# Altium schematic sheet LED Matrix.SchDoc: LED Matrix Page 1
size B; CheckedBy: Lance Bantoto; Engineer: Emily Adam*; Revision: 1; SheetNumber: 1; SheetTotal: 2
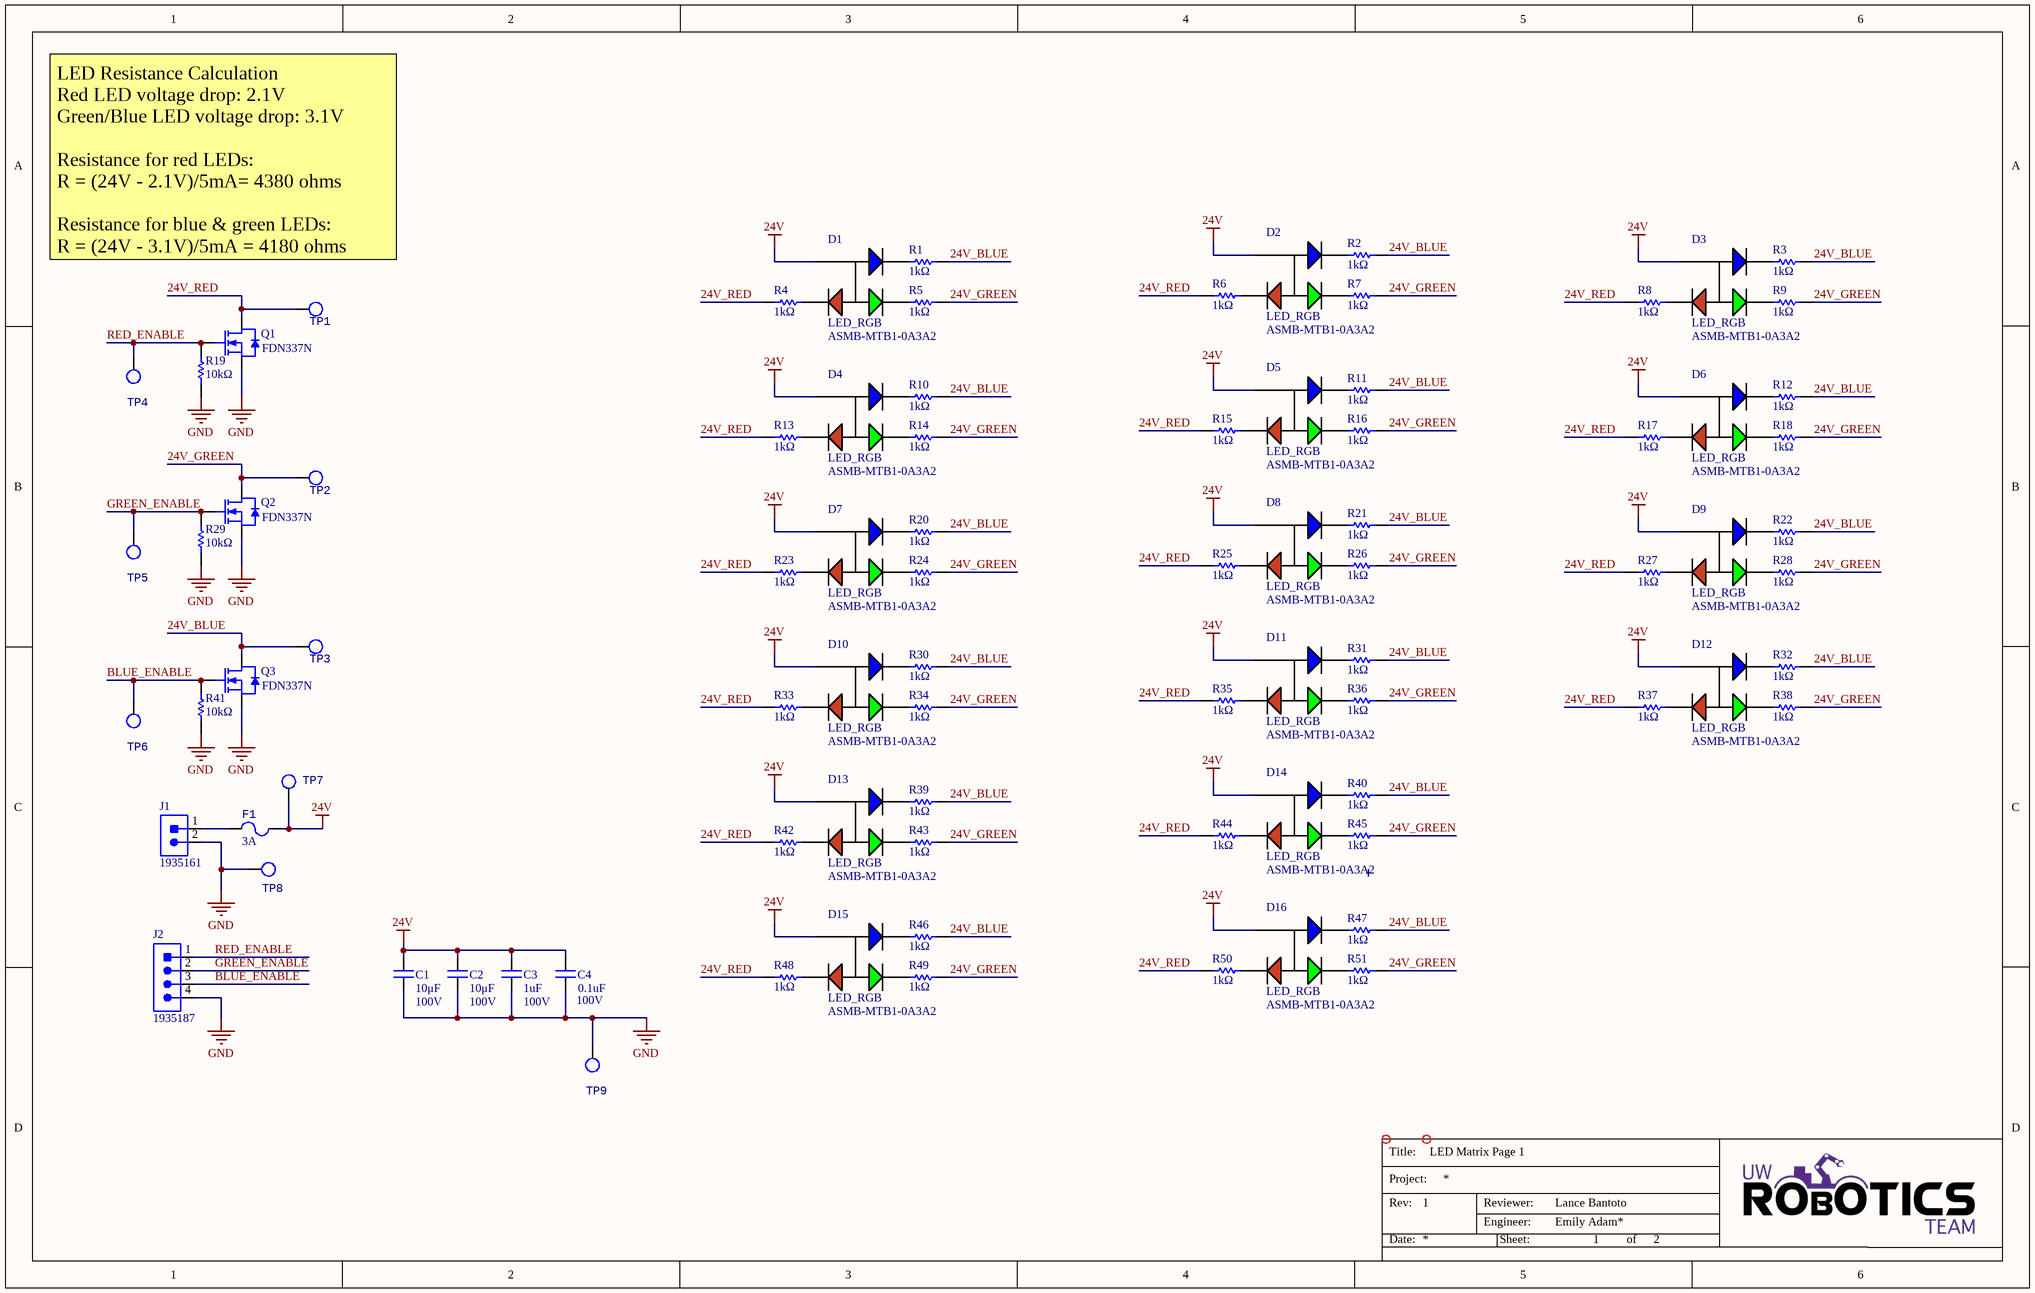
[diagram p0: LED Matrix.SchDoc]

## Parts
C1  value 10μF  Voltage Rating: 100V  [CAP1210]  (hidden comment: CAP_10uF_100V_1210)
C2  value 10μF  Voltage Rating: 100V  [CAP1210]  (hidden comment: CAP_10uF_100V_1210)
C3  Capacitance: 1uF  Voltage Rating: 100V  [CAPC3216X190X50NL20T25]  (hidden comment: CAP_1uF_100V_1206)
C4  Voltage Rating (DC): 100V  Capacitance: 0.1uF  [CAPC3216X180N]  (hidden comment: CAP_0.1uF_100V_1206)
D1  LED_RGB  Manufacturer Part Number 1: ASMB-MTB1-0A3A2  [LED_RGB]
D2  LED_RGB  Manufacturer Part Number 1: ASMB-MTB1-0A3A2  [LED_RGB]
D3  LED_RGB  Manufacturer Part Number 1: ASMB-MTB1-0A3A2  [LED_RGB]
D4  LED_RGB  Manufacturer Part Number 1: ASMB-MTB1-0A3A2  [LED_RGB]
D5  LED_RGB  Manufacturer Part Number 1: ASMB-MTB1-0A3A2  [LED_RGB]
D6  LED_RGB  Manufacturer Part Number 1: ASMB-MTB1-0A3A2  [LED_RGB]
D7  LED_RGB  Manufacturer Part Number 1: ASMB-MTB1-0A3A2  [LED_RGB]
D8  LED_RGB  Manufacturer Part Number 1: ASMB-MTB1-0A3A2  [LED_RGB]
D9  LED_RGB  Manufacturer Part Number 1: ASMB-MTB1-0A3A2  [LED_RGB]
D10  LED_RGB  Manufacturer Part Number 1: ASMB-MTB1-0A3A2  [LED_RGB]
D11  LED_RGB  Manufacturer Part Number 1: ASMB-MTB1-0A3A2  [LED_RGB]
D12  LED_RGB  Manufacturer Part Number 1: ASMB-MTB1-0A3A2  [LED_RGB]
D13  LED_RGB  Manufacturer Part Number 1: ASMB-MTB1-0A3A2  [LED_RGB]
D14  LED_RGB  Manufacturer Part Number 1: ASMB-MTB1-0A3A2  [LED_RGB]
D15  LED_RGB  Manufacturer Part Number 1: ASMB-MTB1-0A3A2  [LED_RGB]
D16  LED_RGB  Manufacturer Part Number 1: ASMB-MTB1-0A3A2  [LED_RGB]
F1  Current Rating: 3A  [FUSE_1206]  (hidden comment: FUSE_3A_1206)
J1  CON_2M_TERM  [1935161]  (value not drawn)
J2  CON_4M_TERM  [1935187]  (value not drawn)
MH1  MOUNTING_HOLES  [MOUNTING_HOLE]  (value not drawn)
MH2  MOUNTING_HOLES  [MOUNTING_HOLE]  (value not drawn)
Q1  Manufacturer Part Number 1: FDN337N  [NMOS_SSOT-3]  (hidden comment: NMOS_30V_2.2A)
Q2  Manufacturer Part Number 1: FDN337N  [NMOS_SSOT-3]  (hidden comment: NMOS_30V_2.2A)
Q3  Manufacturer Part Number 1: FDN337N  [NMOS_SSOT-3]  (hidden comment: NMOS_30V_2.2A)
R1  1kΩ  [RESC2012X60N]
R2  1kΩ  [RESC2012X60N]
R3  1kΩ  [RESC2012X60N]
R4  1kΩ  [RESC2012X60N]
R5  1kΩ  [RESC2012X60N]
R6  1kΩ  [RESC2012X60N]
R7  1kΩ  [RESC2012X60N]
R8  1kΩ  [RESC2012X60N]
R9  1kΩ  [RESC2012X60N]
R10  1kΩ  [RESC2012X60N]
R11  1kΩ  [RESC2012X60N]
R12  1kΩ  [RESC2012X60N]
R13  1kΩ  [RESC2012X60N]
R14  1kΩ  [RESC2012X60N]
R15  1kΩ  [RESC2012X60N]
R16  1kΩ  [RESC2012X60N]
R17  1kΩ  [RESC2012X60N]
R18  1kΩ  [RESC2012X60N]
R19  value 10kΩ  [RESC2012X60N]  (hidden comment: RES_10kΩ_0805)
R20  1kΩ  [RESC2012X60N]
R21  1kΩ  [RESC2012X60N]
R22  1kΩ  [RESC2012X60N]
R23  1kΩ  [RESC2012X60N]
R24  1kΩ  [RESC2012X60N]
R25  1kΩ  [RESC2012X60N]
R26  1kΩ  [RESC2012X60N]
R27  1kΩ  [RESC2012X60N]
R28  1kΩ  [RESC2012X60N]
R29  value 10kΩ  [RESC2012X60N]  (hidden comment: RES_10kΩ_0805)
R30  1kΩ  [RESC2012X60N]
R31  1kΩ  [RESC2012X60N]
R32  1kΩ  [RESC2012X60N]
R33  1kΩ  [RESC2012X60N]
R34  1kΩ  [RESC2012X60N]
R35  1kΩ  [RESC2012X60N]
R36  1kΩ  [RESC2012X60N]
R37  1kΩ  [RESC2012X60N]
R38  1kΩ  [RESC2012X60N]
R39  1kΩ  [RESC2012X60N]
R40  1kΩ  [RESC2012X60N]
R41  value 10kΩ  [RESC2012X60N]  (hidden comment: RES_10kΩ_0805)
R42  1kΩ  [RESC2012X60N]
R43  1kΩ  [RESC2012X60N]
R44  1kΩ  [RESC2012X60N]
R45  1kΩ  [RESC2012X60N]
R46  1kΩ  [RESC2012X60N]
R47  1kΩ  [RESC2012X60N]
R48  1kΩ  [RESC2012X60N]
R49  1kΩ  [RESC2012X60N]
R50  1kΩ  [RESC2012X60N]
R51  1kΩ  [RESC2012X60N]
TP1  TESTPOINT_LOOP  [TESTPOINT_LOOP]  (value not drawn)
TP2  TESTPOINT_LOOP  [TESTPOINT_LOOP]  (value not drawn)
TP3  TESTPOINT_LOOP  [TESTPOINT_LOOP]  (value not drawn)
TP4  TESTPOINT_LOOP  [TESTPOINT_LOOP]  (value not drawn)
TP5  TESTPOINT_LOOP  [TESTPOINT_LOOP]  (value not drawn)
TP6  TESTPOINT_LOOP  [TESTPOINT_LOOP]  (value not drawn)
TP7  TESTPOINT_LOOP  [TESTPOINT_LOOP]  (value not drawn)
TP8  TESTPOINT_LOOP  [TESTPOINT_LOOP]  (value not drawn)
TP9  TESTPOINT_LOOP  [TESTPOINT_LOOP]  (value not drawn)

## Nets
24V: C1.2 C2.2 C3.1 C4.2 D1.4(COMMON_ANODE) D2.4(COMMON_ANODE) D3.4(COMMON_ANODE) D4.4(COMMON_ANODE) D5.4(COMMON_ANODE) D6.4(COMMON_ANODE) D7.4(COMMON_ANODE) D8.4(COMMON_ANODE) D9.4(COMMON_ANODE) D10.4(COMMON_ANODE) D11.4(COMMON_ANODE) D12.4(COMMON_ANODE) D13.4(COMMON_ANODE) D14.4(COMMON_ANODE) D15.4(COMMON_ANODE) D16.4(COMMON_ANODE) F1.1 TP7.1
GND: C1.1 C2.1 C3.2 C4.1 J1.2 J2.4 Q1.2(SOURCE) Q2.2(SOURCE) Q3.2(SOURCE) R19.1 R29.1 R41.1 TP8.1 TP9.1
24V_BLUE: Q3.3(DRAIN) R1.2 R2.2 R3.2 R10.2 R11.2 R12.2 R20.1 R21.1 R22.1 R30.2 R31.2 R32.2 R39.1 R40.2 R46.2 R47.2 TP3.1
24V_GREEN: Q2.3(DRAIN) R5.2 R7.2 R9.2 R14.2 R16.2 R18.2 R24.2 R26.2 R28.2 R34.2 R36.2 R38.2 R43.2 R45.2 R49.2 R51.2 TP2.1
24V_RED: Q1.3(DRAIN) R4.1 R6.1 R8.1 R13.1 R15.1 R17.1 R23.2 R25.1 R27.1 R33.1 R35.1 R37.1 R42.1 R44.1 R48.1 R50.1 TP1.1
BLUE_ENABLE: J2.3 Q3.1(GATE) R41.2 TP6.1
GREEN_ENABLE: J2.2 Q2.1(GATE) R29.2 TP5.1
RED_ENABLE: J2.1 Q1.1(GATE) R19.2 TP4.1
NetD1_1: D1.1(CATHODE_(RED)) R4.2
NetD1_2: D1.2(CATHODE_(GREEN)) R5.1
NetD1_3: D1.3(CATHODE_(BLUE)) R1.1
NetD2_1: D2.1(CATHODE_(RED)) R6.2
NetD2_2: D2.2(CATHODE_(GREEN)) R7.1
NetD2_3: D2.3(CATHODE_(BLUE)) R2.1
NetD3_1: D3.1(CATHODE_(RED)) R8.2
NetD3_2: D3.2(CATHODE_(GREEN)) R9.1
NetD3_3: D3.3(CATHODE_(BLUE)) R3.1
NetD4_1: D4.1(CATHODE_(RED)) R13.2
NetD4_2: D4.2(CATHODE_(GREEN)) R14.1
NetD4_3: D4.3(CATHODE_(BLUE)) R10.1
NetD5_1: D5.1(CATHODE_(RED)) R15.2
NetD5_2: D5.2(CATHODE_(GREEN)) R16.1
NetD5_3: D5.3(CATHODE_(BLUE)) R11.1
NetD6_1: D6.1(CATHODE_(RED)) R17.2
NetD6_2: D6.2(CATHODE_(GREEN)) R18.1
NetD6_3: D6.3(CATHODE_(BLUE)) R12.1
NetD7_1: D7.1(CATHODE_(RED)) R23.1
NetD7_2: D7.2(CATHODE_(GREEN)) R24.1
NetD7_3: D7.3(CATHODE_(BLUE)) R20.2
NetD8_1: D8.1(CATHODE_(RED)) R25.2
NetD8_2: D8.2(CATHODE_(GREEN)) R26.1
NetD8_3: D8.3(CATHODE_(BLUE)) R21.2
NetD9_1: D9.1(CATHODE_(RED)) R27.2
NetD9_2: D9.2(CATHODE_(GREEN)) R28.1
NetD9_3: D9.3(CATHODE_(BLUE)) R22.2
NetD10_1: D10.1(CATHODE_(RED)) R33.2
NetD10_2: D10.2(CATHODE_(GREEN)) R34.1
NetD10_3: D10.3(CATHODE_(BLUE)) R30.1
NetD11_1: D11.1(CATHODE_(RED)) R35.2
NetD11_2: D11.2(CATHODE_(GREEN)) R36.1
NetD11_3: D11.3(CATHODE_(BLUE)) R31.1
NetD12_1: D12.1(CATHODE_(RED)) R37.2
NetD12_2: D12.2(CATHODE_(GREEN)) R38.1
NetD12_3: D12.3(CATHODE_(BLUE)) R32.1
NetD13_1: D13.1(CATHODE_(RED)) R42.2
NetD13_2: D13.2(CATHODE_(GREEN)) R43.1
NetD13_3: D13.3(CATHODE_(BLUE)) R39.2
NetD14_1: D14.1(CATHODE_(RED)) R44.2
NetD14_2: D14.2(CATHODE_(GREEN)) R45.1
NetD14_3: D14.3(CATHODE_(BLUE)) R40.1
NetD15_1: D15.1(CATHODE_(RED)) R48.2
NetD15_2: D15.2(CATHODE_(GREEN)) R49.1
NetD15_3: D15.3(CATHODE_(BLUE)) R46.1
NetD16_1: D16.1(CATHODE_(RED)) R50.2
NetD16_2: D16.2(CATHODE_(GREEN)) R51.1
NetD16_3: D16.3(CATHODE_(BLUE)) R47.1
NetF1_2: F1.2 J1.1

## Notes on the sheet
- LED Resistance Calculation
  Red LED voltage drop: 2.1V
  Green/Blue LED voltage drop: 3.1V
  Resistance for red LEDs:
  R = (24V - 2.1V)/5mA= 4380 ohms
  Resistance for blue & green LEDs:
  R = (24V - 3.1V)/5mA = 4180 ohms
- Title:
- Project:
- Date:
- Rev:
- Reviewer:
- Engineer:
- Sheet:
- of

## Library data of the parts
C1 C2 = CAP_10uF_100V_1210: CAP CER 10uF 100V X7S 10% 1210; Manufacturer 1: Murata; Manufacturer Part Number 1: GRM32EC72A106KE05L; Package/Footprint: 1210; Supplier 1: Digi-Key; Tolerance: 10%; Supplier Part Number 1: 490-16266-1-ND; Dielectric: X7S; Mounting Type: SMD
C3 = CAP_1uF_100V_1206: CAP CER 1UF 100V X7R 1206; Manufacturer: Murata; Manufacturer Part Number: GCJ31CR72A105KA01L; Package/Footprint: 1206; Supplier 1: Digi-Key; Supplier Part Number 1: 490-16468-1-ND; Mounting Type: SMD
C4 = CAP_0.1uF_100V_1206: CAP CER 0.1UF 100V C0G/NP0 1206; Manufacturer: Murata; Manufacturer Part Number: GRM31C5C2A104JA01L; Dielectric: C0G; Tolerance: 5%; Supplier 1: Digi-Key; RoHS: No; Category: Ceramic Capacitors; Stock 1: 18337; Pricing 1: 1=0.69000, 10=0.48900, 50=0.36940, 100=0.32180, 500=0.23838, 1000=0.20261 (USD); Length: 3.2mm; Width: 1.6mm; Thickness: 1.6mm; ComponentLink1URL: https://psearch.en.murata.com:443/capacitor/product/GRM31C5C2A104JA01%23.pdf?src-supplier=IHS+Markit; ComponentLink1Description: https://psearch.en.murata.com:443/capacitor/product/GRM31C5C2A104JA01%23.pdf?src-supplier=IHS+Markit; ComponentLink2URL: https://search.murata.co.jp/Ceramy/image/img/A01X/G101/ENG/GRM31C5C2A104JA01-01.pdf?src-supplier=Digi-Key; ComponentLink2Description: https://search.murata.co.jp/Ceramy/image/img/A01X/G101/ENG/GRM31C5C2A104JA01-01.pdf?src-supplier=Digi-Key; ComponentLink3URL: http://search.murata.co.jp/Ceramy/image/img/A01X/G101/ENG/GRM31C5C2A104JA01-01.pdf?src-supplier=Digi-Key; ComponentLink3Description: http://search.murata.co.jp/Ceramy/image/img/A01X/G101/ENG/GRM31C5C2A104JA01-01.pdf?src-supplier=Digi-Key; Supplier Part Number 1: 490-16315-1-ND
D1-D16 = LED_RGB: LED RGB DIFFUSED 4PLCC SMD; Manufacturer 1: Broadcom; Color: Blue,Green,Red; Lens Color: White; Viewing Angle: 115°; Lens Style: Round; Luminous Intensity: 350mcd; Dominant Wavelength: 470nm; Forward Voltage: 3.1V; Test Current: 20mA; Package/Footprint: 4-PLCC; Supplier 1: Digi-Key; Case/Package: PLCC; Number of Pins: 4; Lens Transparency: Diffused; Length: 3.2mm; Height: 1.9mm; Width: 2.8mm; Supplier Part Number 1: 516-3280-1-ND; Mounting Type: SMD
F1 = FUSE_3A_1206: FUSE BOARD MNT 3A 32VAC/VDC 1206; Manufacturer 1: Littelfuse; Manufacturer Part Number 1: 0466003.NR; Working Voltage: 32V; Response Time: Fast Blow; Package/Footprint: 1206; Supplier 1: Digi-Key; Supplier Part Number 1: F1458CT-ND; Mounting Type: SMD
J1 = CON_2M_TERM: TERM BLK 2POS SIDE ENTRY 5MM; Manufacturer 1: Phoenix Contact; Max Current Rating: 16A; Current: 18A; Voltage: 300V; Package/Footprint: SMD; Supplier 1: Digi-Key; Supplier Part Number 1: 277-1667-ND; Manufacturer Part Number 1: 1935161; Mounting Type: TH
J2 = CON_4M_TERM: TERM BLK 4POS SIDE ENTRY 5MM PCB; Manufacturer 1: Phoenix Contact; Current: 18A; Voltage: 300V; Wire Gauge: 12-26AWG; Screw Thread: M2.6; Package/Footprint: TH; Supplier Part Number 1: 277-1579-ND; Supplier 1: Digi-Key; Pitch: 5mm; Mounting Type: TH; Manufacturer Part Number 1: 1935187
MH1 MH2 = MOUNTING_HOLES: 6cm x 6cm
Q1-Q3 = NMOS_30V_2.2A: MOSFET N-CH 30V 2.2A SUPERSOT3; Manufacturer 1: ON Semiconductor / Fairchild; Element Configuration: Single; Drain to Source Resistance: 65mR; Turn-Off Delay Time: 17ns; Gate to Source Voltage (Vgs): 8V; Rise Time: 10ns; Max Power Dissipation: 500mW; Fall Time: 4ns; Input Capacitance: 300pF; Number of Elements: 1; Threshold Voltage: 700mV; Package/Footprint: SuperSOT-3; Supplier 1: Digi-Key; Category: MOSFETs; Max Operating Temperature: 150°C; Continuous Drain Current (ID): 2.2A; Drain to Source Breakdown Voltage: 30V; Power Dissipation: 500mW; Turn-On Delay Time: 4ns; Rds On Max: 65mR; Drain to Source Voltage (Vdss): 30V; On-State Resistance: 65mR; Voltage Rating (DC): 30V; Current Rating: 2.2A; Dual Supply Voltage: 30V; Nominal Vgs: 700mV; Supplier Part Number 1: FDN337NCT-ND; Mounting Type: SMD
R1-R18 R20-R28 R30-R40 R42-R51 = RES_1kΩ_0805: RES SMD 1K OHM 1% 1/8W 0805; Manufacturer 1: Yageo; Manufacturer Part Number 1: RC0805FR-071KL; Power Rating: 125mW; Temperature Coefficient: 25ppm/°C; Voltage Rating: 150V; Supplier 1: Digi-Key; Case Code (Imperial): 0805; Case Code (Metric): 2012; Min Operating Temperature: -55°C; Max Operating Temperature: 155°C; Resistance: 1K; Tolerance: 1%; Termination: SMD/SMT; Supplier Part Number 1: 311-1.00KCRCT-ND; Value: 1kΩ; Package: 0805 (2012 Metric); Mount: Surface Mount; Case/Package: 0805; Number of Pins: 2; Weight: 0.000194oz; Contact Plating: Tin; Composition: Thin Film; Number of Terminations: 2; Voltage Rating (DC): 150V; Max Power Dissipation: 125mW; Features: Moisture Resistant,Automotive AEC-Q200,Anti-Sulfur; Military Standard: Not; Length: 2mm; Height: 0.022inch; Width: 0.049inch; Depth: 1.25mm; REACH SVHC: Unknown
R19 R29 R41 = RES_10kΩ_0805: RES SMD 10K OHM 1% 1/8W 0805; Manufacturer 1: Yageo; Manufacturer Part Number 1: RC0805FR-0710KL; Power Rating: 125mW; Supplier 1: Digi-Key; Case Code (Metric): 2012; Min Operating Temperature: -55°C; Max Operating Temperature: 155°C; Resistance: 10K; Tolerance: 1%; Termination: SMD/SMT; Supplier Part Number 1: 311-10.0KCRCT-ND; Package: 0805 (2012 Metric); Case Code (Imperial): 0805
TP1-TP9 = TESTPOINT_LOOP: PC TEST POINT MINIATURE WHITE; Manufacturer 1: Keystone Electronics; Manufacturer Part Number 1: 5002; Package/Footprint: TH; Supplier Part Number 1: 36-5002-ND; Supplier 1: Digi-Key; Mounting Type: TH